# EasyEDA Pro project TC364核心板V2.1.epro

# Schematic TC364核心板V2.1

## Sheets
1 P1: Board Name: TC364核心板V2.0; Create Date: 2024-12-10
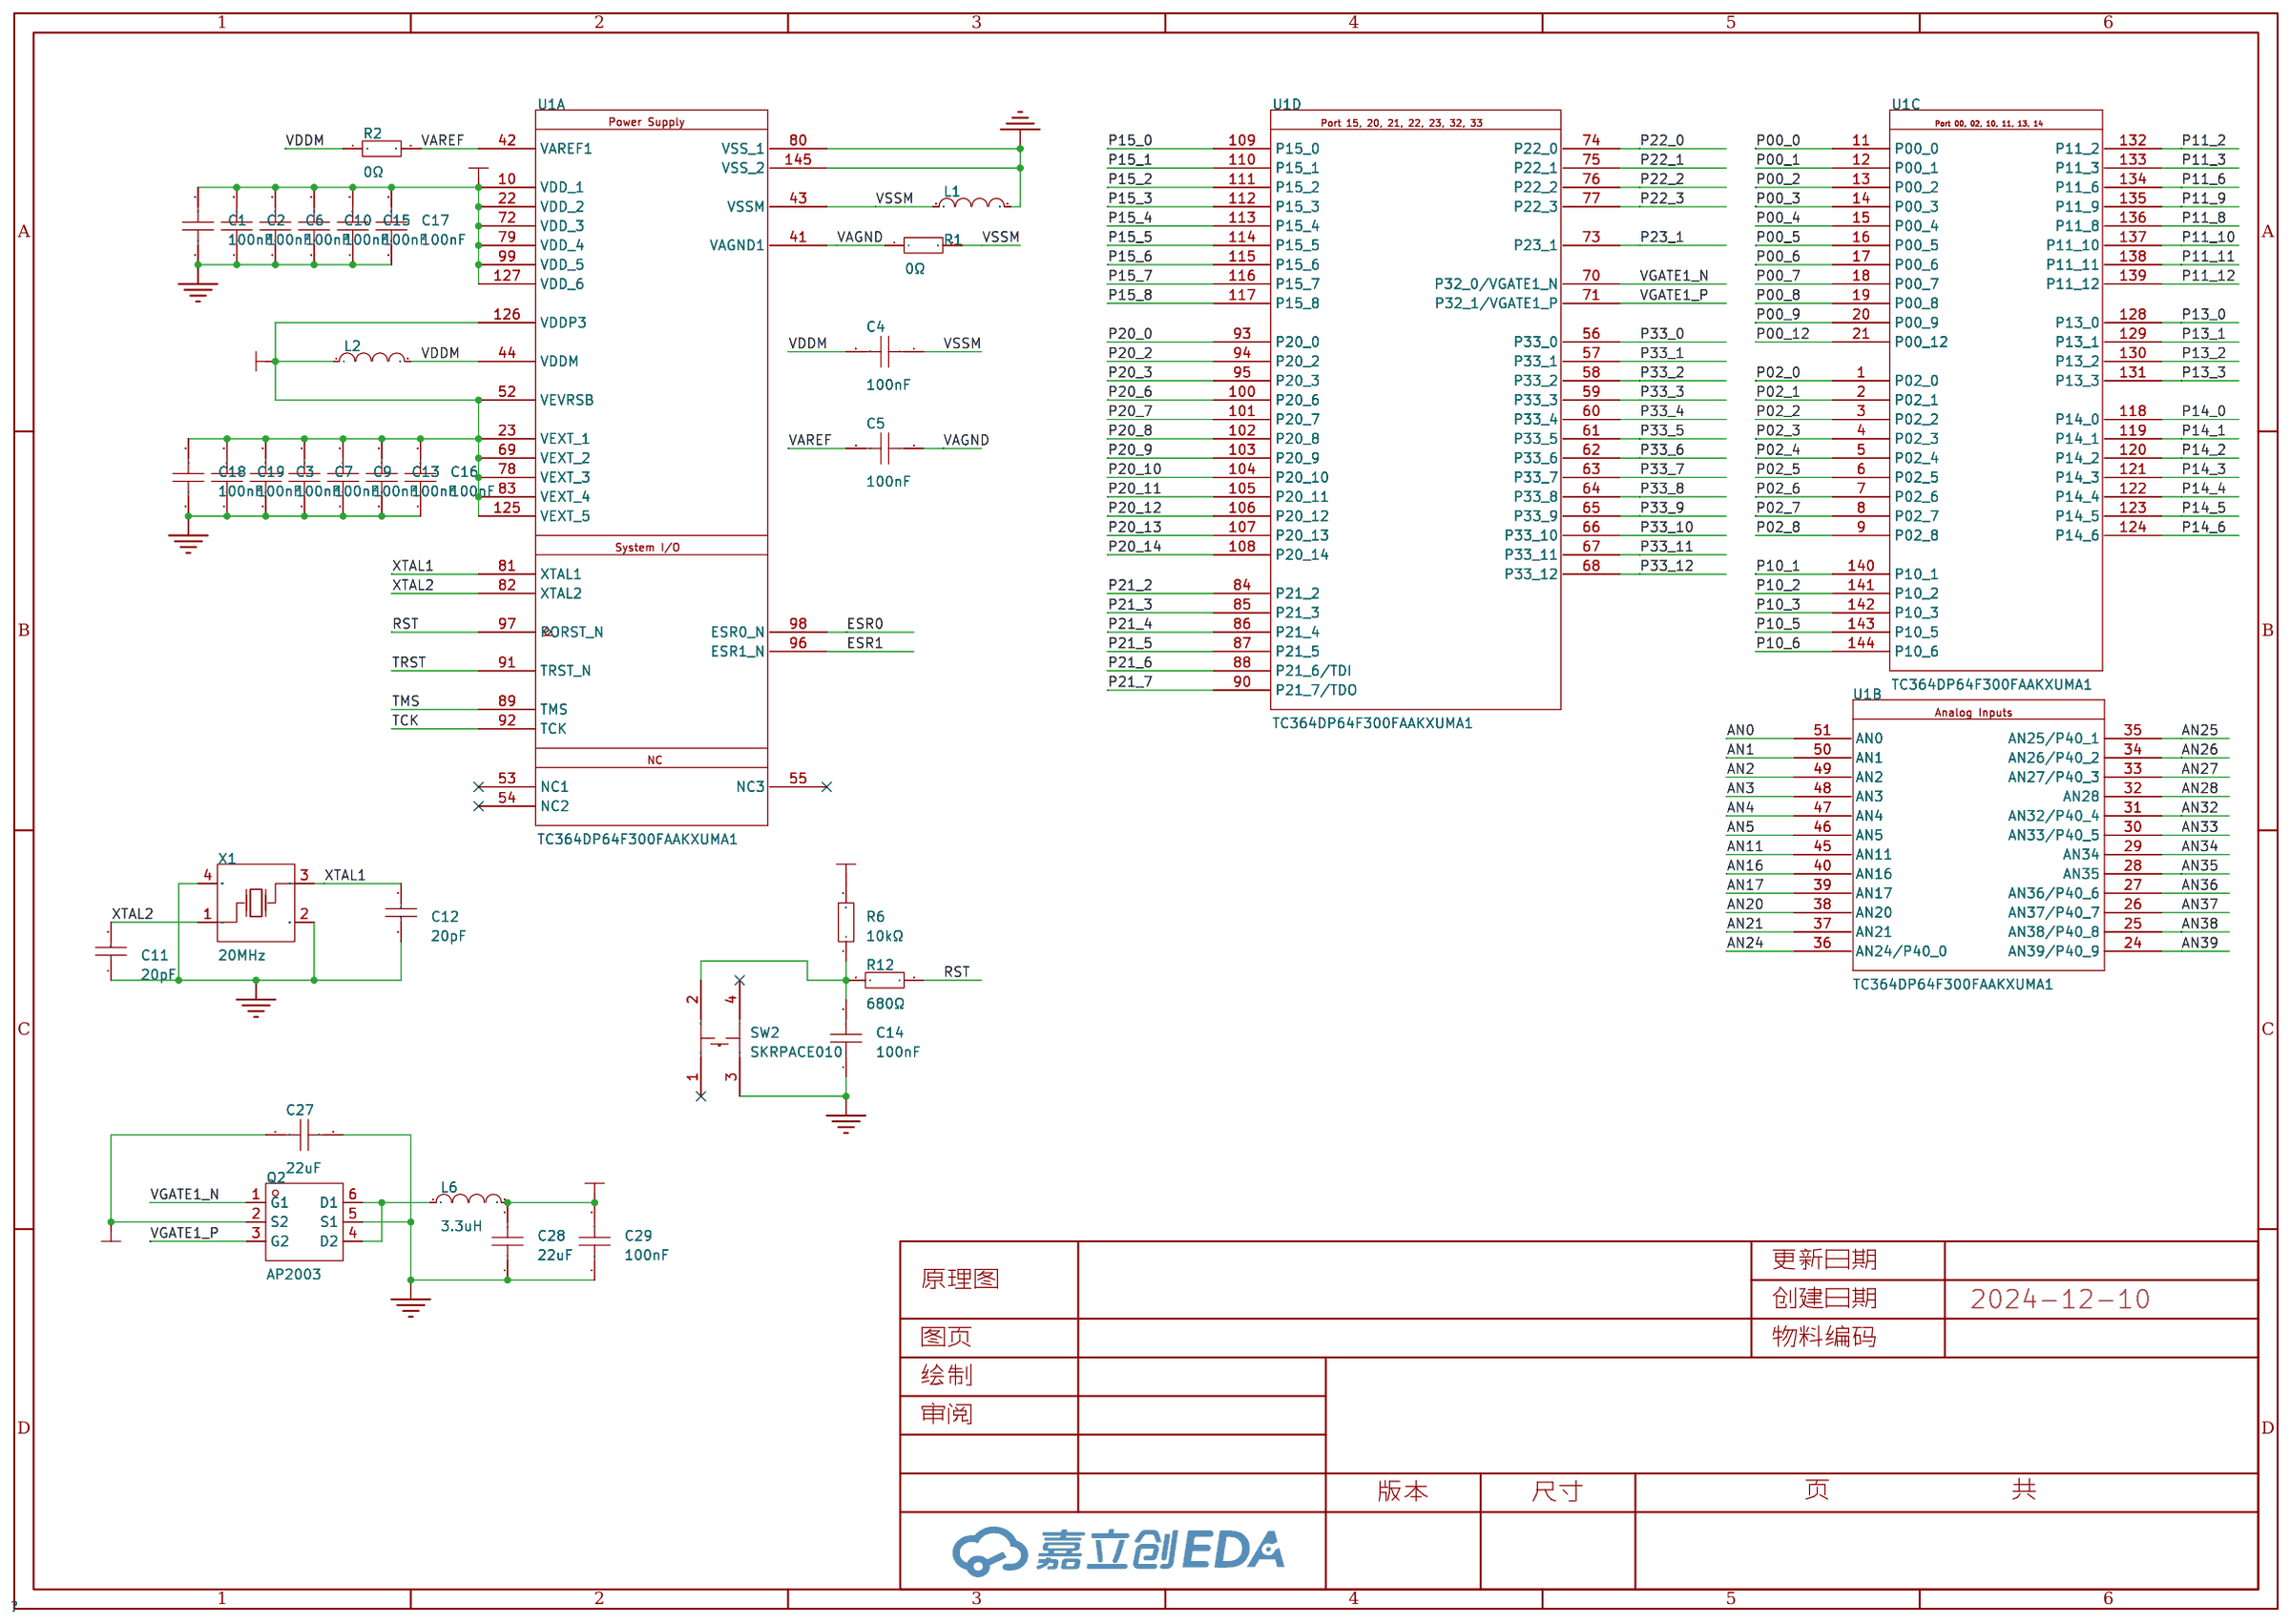
[diagram p0: P1]
2 P2: Board Name: TC364核心板V2.1
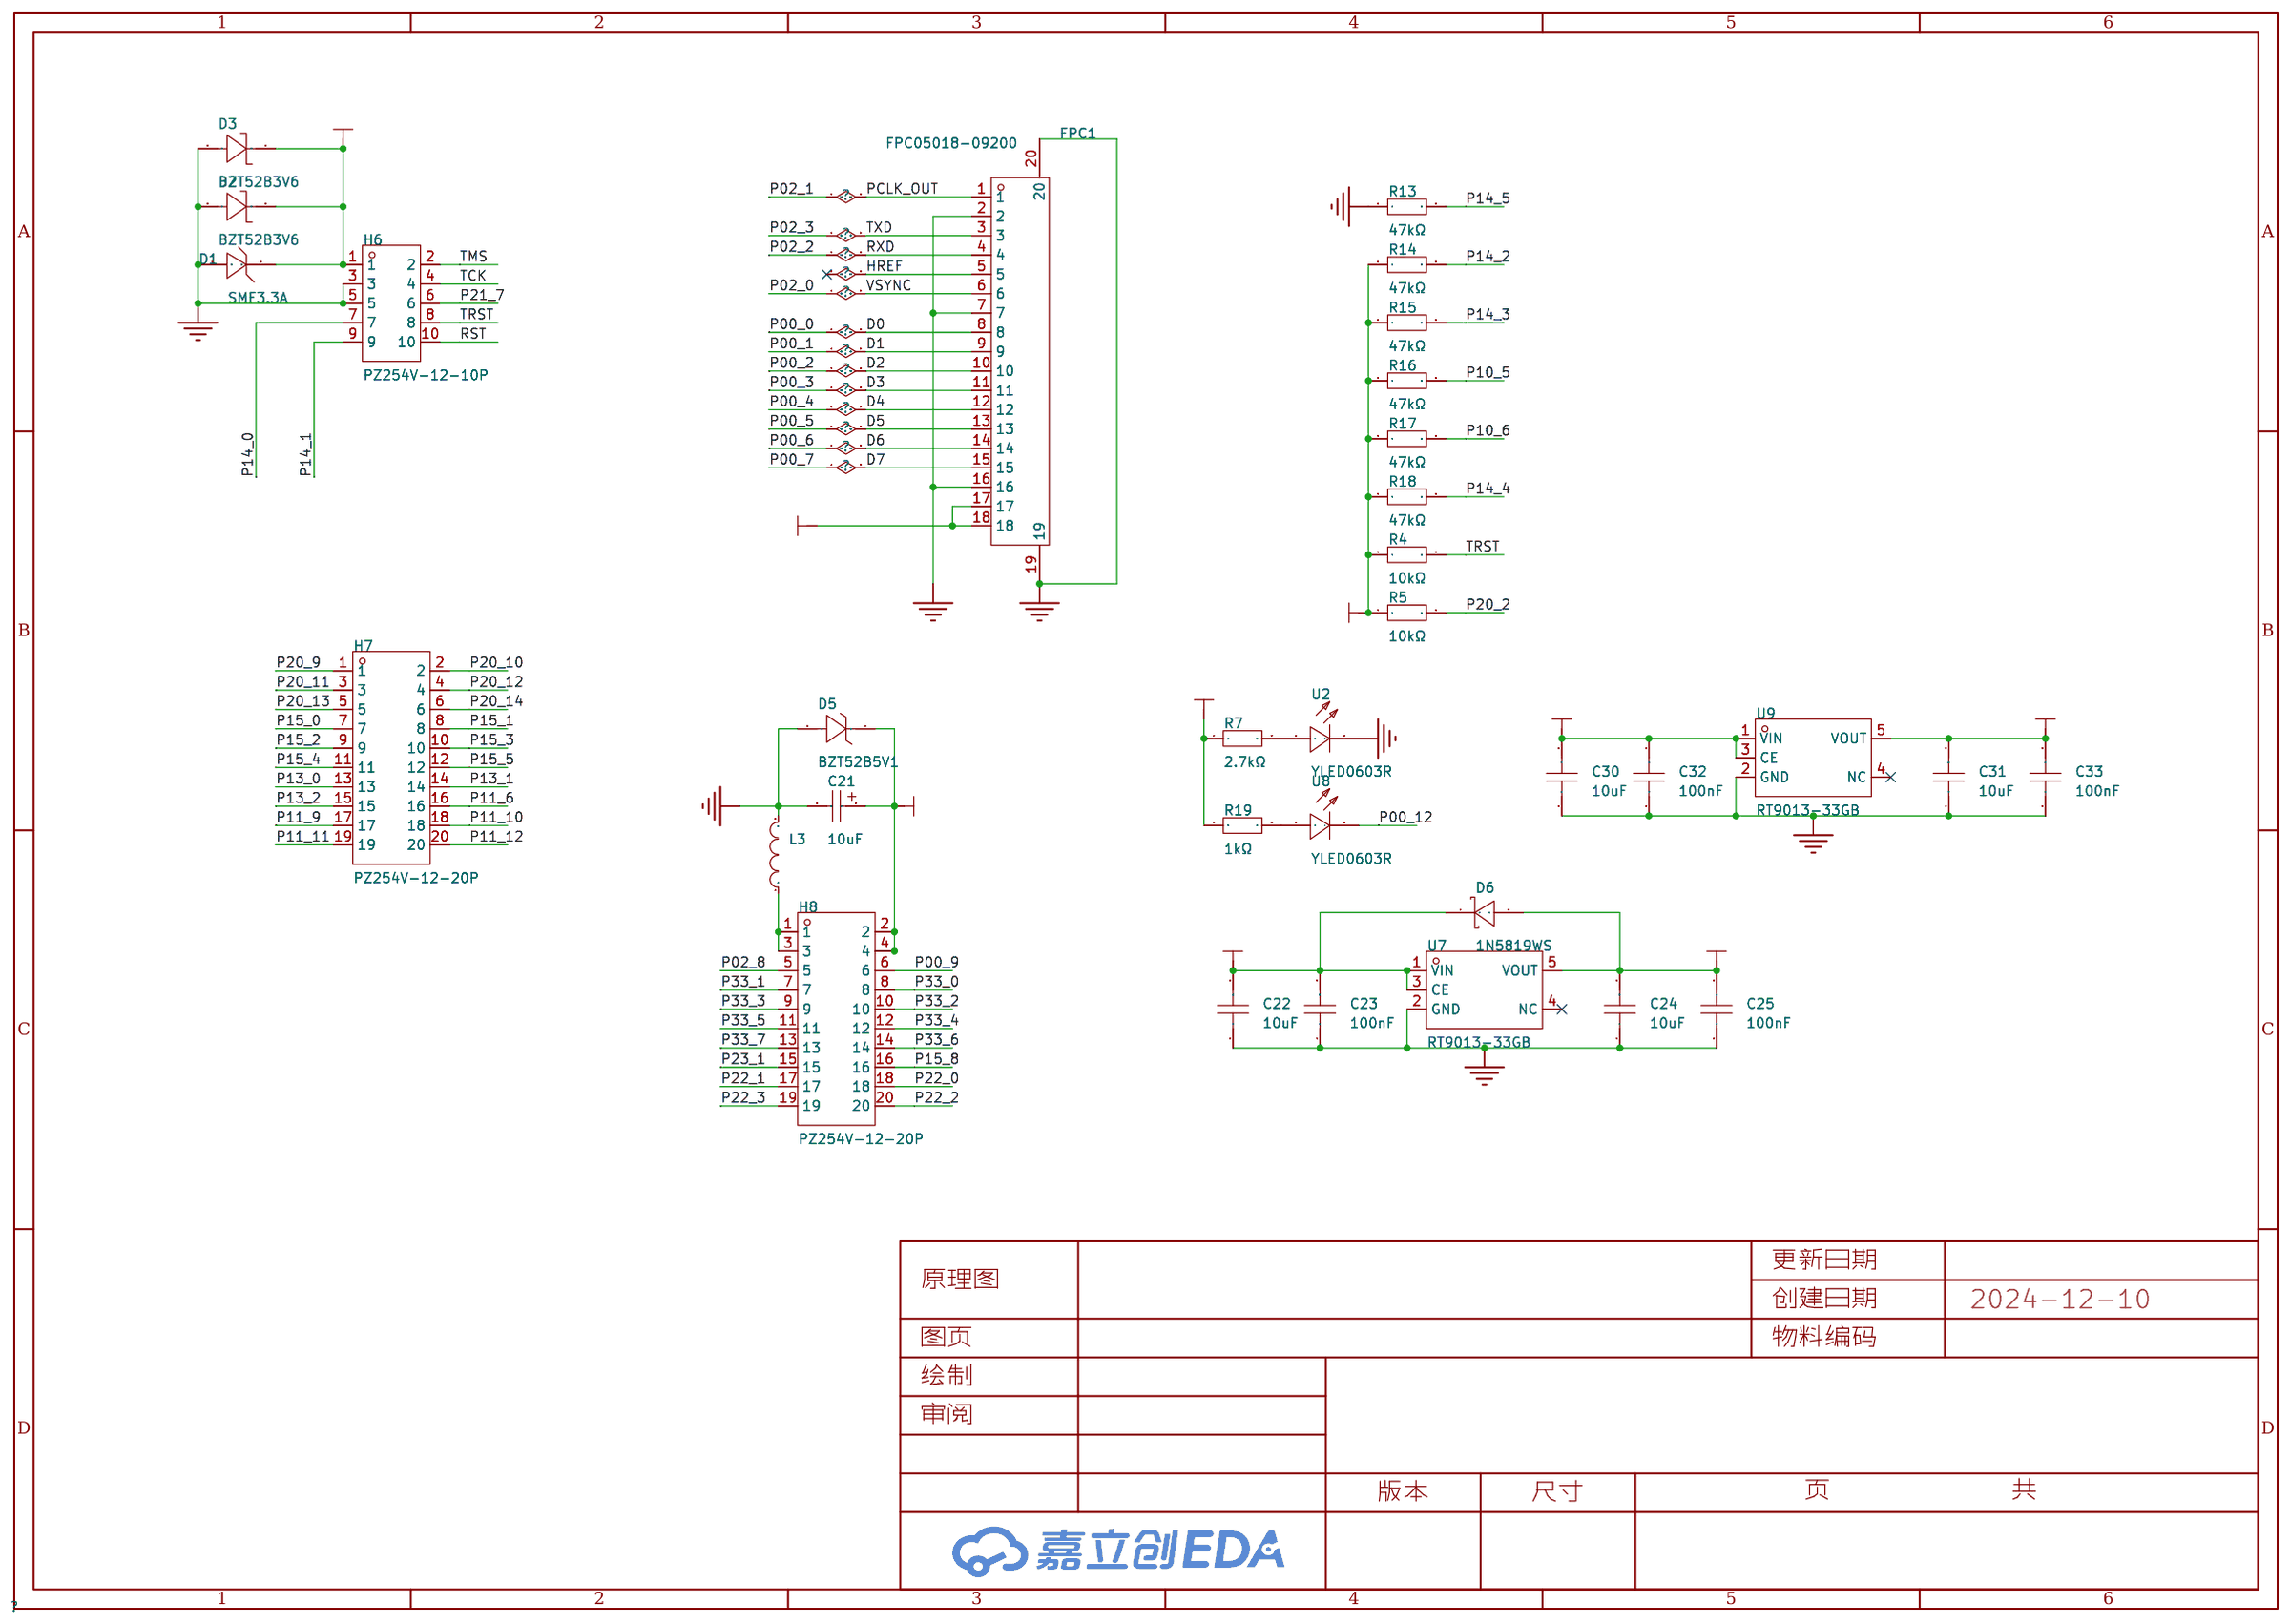
[diagram p1: P2]

## Parts
sheet P1
C1  100nF  [C0603]
C2  100nF  [C0603]
C3  100nF  [C0603]
C4  100nF  [C0603]
C5  100nF  [C0603]
C6  100nF  [C0603]
C7  100nF  [C0603]
C9  100nF  [C0603]
C10  100nF  [C0603]
C11  20pF  [C0603]
C12  20pF  [C0603]
C13  100nF  [C0603]
C14  100nF  [C0603]
C15  100nF  [C0603]
C16  100nF  [C0603]
C17  100nF  [C0603]
C18  100nF  [C0603]
C19  100nF  [C0603]
C27  22uF  [C0603]
C28  22uF  [C0603]
C29  100nF  [C0603]
L1  CBG160808U000T  [L0603]
L2  CBG160808U000T  [L0603]
L6  3.3uH  [IND-SMD_L4.4-W4.2]
Q2  AP2003  [SOT-23-6_L2.9-W1.6-P0.95-LS2.8-BR]
R1  0Ω  [R0603]
R2  0Ω  [R0603]
R6  10kΩ  [R0603]
R12  680Ω  [R0603]
SW2  SKRPACE010  [KEY-SMD_4P-L4.2-W3.2-P2.20-LS4.6]
U1  TC364DP64F300FAAKXUMA1  [PG-TQFP-144_L16.0-W16.0-P0.40-LS18.0-BR-EP5.7]  (sections 1,2,3,4)
X1  20MHz  [OSC-SMD_4P-L3.2-W2.5-BL]
sheet P2
C21  10uF  [CAP-SMD_L3.2-W1.6-RD-C7171]
C22  10uF  [C0603]
C23  100nF  [C0603]
C24  10uF  [C0603]
C25  100nF  [C0603]
C30  10uF  [C0603]
C31  10uF  [C0603]
C32  100nF  [C0603]
C33  100nF  [C0603]
D1  SMF3.3A  [SOD-123_L2.8-W1.8-LS3.7-RD]
D2  BZT52B3V6  [SOD-123_L2.7-W1.6-LS3.7-RD-A]
D3  BZT52B3V6  [SOD-123_L2.7-W1.6-LS3.7-RD-A]
D5  BZT52B5V1  [SOD-123_L2.7-W1.6-LS3.7-RD]
D6  1N5819WS  [SOD-323_L1.8-W1.3-LS2.5-RD]
FPC1  FPC05018-09200  [FPC-SMD_FPC05018-09200]
H6  PZ254V-12-10P  [HDR-TH_10P-P2.54-V-M-R2-C5-S2.54]
H7  PZ254V-12-20P  [HDR-TH_20P-P2.54-V-M-R2-C10-S2.54]
H8  PZ254V-12-20P  [HDR-TH_20P-P2.54-V-M-R2-C10-S2.54]
L3  CBG201209U000T  [L0805]
R4  10kΩ  [R0603]
R5  10kΩ  [R0603]
R7  2.7kΩ  [R0603]
R13  47kΩ  [R0603]
R14  47kΩ  [R0603]
R15  47kΩ  [R0603]
R16  47kΩ  [R0603]
R17  47kΩ  [R0603]
R18  47kΩ  [R0603]
R19  1kΩ  [R0603]
U2  YLED0603R  [LED0603-FD]
U7  RT9013-33GB  [SOT-23-5_L2.9-W1.6-P0.95-LS2.8-BR]
U8  YLED0603R  [LED0603-FD]
U9  RT9013-33GB  [SOT-23-5_L2.9-W1.6-P0.95-LS2.8-BR]

## Library data of the parts
C1-C7 C9 C10 C13-C19 C23 C25 C29 C32 C33 = CC0603KRX7R9BB104: 容值:100nF;精度:±10%;额定电压:50V;材质(温度系数):X7R;; LCSC Part Name: 100nF ±10% 50V; Supplier Part: C14663; Manufacturer: YAGEO(国巨); Supplier Footprint: 0603; JLCPCB Part Class: 基础库; Datasheet: https://atta.szlcsc.com/upload/public/pdf/source/20180910/C282072_33301C7F631E79921B82A8DAC6BCC5B3.pdf; Supplier: LCSC; Tolerance: ±10%; Voltage Rated: 50V; Temperature Coefficient: X7R
C11 C12 = CC0603JRNPO9BN200: 容值:20pF;精度:±5%;额定电压:50V;材质(温度系数):NP0;; LCSC Part Name: 20pF ±5% 50V; Supplier Part: C105621; Manufacturer: YAGEO(国巨); Supplier Footprint: 0603; JLCPCB Part Class: 扩展库; Datasheet: https://atta.szlcsc.com/upload/public/pdf/source/20170505/1493957838062.pdf; Supplier: LCSC; Tolerance: ±5%; Voltage Rated: 50V; Temperature Coefficient: NP0
C27 C28 = CL10A226MP8NUNE: 容值:22uF;精度:±20%;额定电压:10V;材质(温度系数):X5R;; LCSC Part Name: 22uF ±20% 10V; Supplier Part: C86295; Manufacturer: SAMSUNG(三星); Supplier Footprint: 0603; JLCPCB Part Class: 扩展库; Datasheet: https://atta.szlcsc.com/upload/public/pdf/source/20160218/1457707763339.pdf; Supplier: LCSC; Tolerance: ±20%; Voltage Rated: 10V; Temperature Coefficient: X5R
L1 L2 = CBG160808U000T: 标称阻抗@测试频率:0Ω@100MHz;直流电阻(RDC):100mΩ;; LCSC Part Name: 单路 0603磁珠 阻抗0Ω@100MHz; Supplier Part: C43163; Manufacturer: FH(风华); Supplier Footprint: 0603; JLCPCB Part Class: 扩展库; Datasheet: https://atta.szlcsc.com/upload/public/pdf/source/20190129/C361667_1614D407CC98D1D3CFBD9E1F7511C14D.pdf; Supplier: LCSC; Impedance @ Frequency: 0Ω@100MHz; DC Resistance: 100mΩ; Current Rating: 800mA; Circuits: 1
L6 = FAUL0420-3R3MT: 电感值:3.3uH;精度:±20%;额定电流:3.3A;饱和电流(Isat):3.5A;类型:一体成型电感;; LCSC Part Name: 3.3uH ±20% 3.5A; Supplier Part: C3040384; Manufacturer: cjiang(长江微电); Supplier Footprint: SMD,4.2x4.4mm; JLCPCB Part Class: 扩展库; Datasheet: https://atta.szlcsc.com/upload/public/pdf/source/20221201/43419F042EC034C99E4B70E898E2F3B3.pdf; Supplier: LCSC; Tolerance: ±20%; Rated Current: 3.3A; Saturation Current (Isat): 3.5A; DC Resistance (DCR): 87mΩ; Type: 一体成型电感; Ratings: AEC-Q200
Q2 = AP2003: 类型:1个N沟道+1个P沟道;漏源电压(Vdss):20V;连续漏极电流(Id):3A;导通电阻(RDS(on)@Vgs,Id):75mΩ@4.5V,2.5A;功率(Pd):800mW;阈值电压(Vgs(th)@Id):700mV@250uA;; LCSC Part Name: 1个N沟道+1个P沟道 耐压:20V 电流:3A; Supplier Part: C2849575; Manufacturer: ALLPOWER(铨力); Supplier Footprint: SOT-23-6; JLCPCB Part Class: 扩展库; Datasheet: https://atta.szlcsc.com/upload/public/pdf/source/20210723/C2849575_D5662A091ADF76BB7231C05490DE9B38.pdf; Supplier: LCSC; Type: 1个N沟道+1个P沟道; Drain Source Voltage (Vdss): 20V; Continuous Drain Current (Id): 3A; Drain Source On Resistance (RDS(on)@Vgs,Id): 75mΩ@4.5V,2.5A; Power Dissipation (Pd): 800mW; Gate Threshold Voltage (Vgs(th)@Id): 700mV@250uA; Total Gate Charge (Qg@Vgs): 3.2nC; Input Capacitance (Ciss@Vds): 325pF@10V; Reverse Transfer Capacitance (Crss@Vds): 37pF@10V; Operating Temperature: -55℃~+150℃
R1 R2 = 0603WAF0000T5E: 电阻类型:厚膜电阻;阻值:0Ω;精度:±1%;功率:100mW;最大工作电压:75V;; LCSC Part Name: 0Ω ±1% 100mW 厚膜电阻; Supplier Part: C21189; Manufacturer: UNI-ROYAL(厚声); Supplier Footprint: 0603; JLCPCB Part Class: 基础库; Datasheet: https://atta.szlcsc.com/upload/public/pdf/source/20200306/C422600_1E6D84923E4A46A82E41ADD87F860B5C.pdf; Supplier: LCSC; Type: 厚膜电阻; Tolerance: ±1%; Power(Watts): 100mW; Overload Voltage (Max): 75V; Operating Temperature Range: -55℃~+155℃
R4-R6 = 0603WAF1002T5E: 电阻类型:厚膜电阻;阻值:10kΩ;精度:±1%;功率:100mW;最大工作电压:75V;温度系数:±100ppm/℃;; LCSC Part Name: 厚膜电阻 10kΩ ±1% 100mW; Supplier Part: C25804; Manufacturer: UNI-ROYAL(厚声); Supplier Footprint: 0603; JLCPCB Part Class: 基础库; Datasheet: https://atta.szlcsc.com/upload/public/pdf/source/20200306/C422600_1E6D84923E4A46A82E41ADD87F860B5C.pdf; Supplier: LCSC; Type: 厚膜电阻; Tolerance: ±1%; Power(Watts): 100mW; Overload Voltage (Max): 75V; Temperature Coefficient: ±100ppm/℃; Operating Temperature Range: -55℃~+155℃
R12 = 0603WAF6800T5E: 电阻类型:厚膜电阻;阻值:680Ω;精度:±1%;功率:100mW;最大工作电压:75V;温度系数:±100ppm/℃;; LCSC Part Name: 680Ω ±1% 100mW 厚膜电阻; Supplier Part: C23228; Manufacturer: UNI-ROYAL(厚声); Supplier Footprint: 0603; JLCPCB Part Class: 基础库; Datasheet: https://atta.szlcsc.com/upload/public/pdf/source/20200306/C422600_1E6D84923E4A46A82E41ADD87F860B5C.pdf; Supplier: LCSC; Type: 厚膜电阻; Tolerance: ±1%; Power(Watts): 100mW; Overload Voltage (Max): 75V; Temperature Coefficient: ±100ppm/℃; Operating Temperature Range: -55℃~+155℃
SW2 = SKRPACE010: 电路结构:单刀单掷;按钮形状:椭圆形按钮;安装方式:立贴;开关长度:4.2mm;开关宽度:3.2mm;开关高度:2.5mm;触点电流:50mA;额定电压(DC):16V;带灯:-;机械寿命:-;; LCSC Part Name: 4.2*3.2*2.5mm 立贴 轻触开关; Supplier Part: C139797; Manufacturer: ALPSALPINE(阿尔卑斯阿尔派); Supplier Footprint: SMD; JLCPCB Part Class: 扩展库; Datasheet: https://atta.szlcsc.com/upload/public/pdf/source/20171113/C139797_15105612676371115729.pdf; Supplier: LCSC; Circuit: 单刀单掷; Actuator Style: 椭圆形按钮; Mounting Style: 立贴; Switch Length: 4.2mm; Switch Width: 3.2mm; Switch Height: 2.5mm; Contact Current: 50mA; Voltage Rating (DC): 16V
U1 = TC364DP64F300FAAKXUMA1: CPU内核:其他系列;程序存储容量:4MB;RAM总容量:672KB;GPIO端口数量:-;工作电压范围:-;CPU最大主频:300MHz;程序存储器类型:FLASH;; Supplier Part: C1855763; Manufacturer: Infineon(英飞凌); Supplier Footprint: TQFP-144(16x16); JLCPCB Part Class: Extended Part; Supplier: LCSC; CPU Core: 其他系列; Program Storage Size: 4MB; RAM Size: 672KB; CPU Maximum Speed: 300MHz; Program Memory Type: FLASH; Operating Temperature Range: -40℃~+125℃; Peripheral/Function: DMA；看门狗；LIN总线协议；PWM；以太网协议栈; communication protocol: 以太网协议; Watchdog: 有; Direct Memory Access: 有; Internal Oscillator: 有
X1 = X322520MSB4SI: 晶振类型:贴片晶振;频率:20MHz;常温频差:±10ppm;外接负载电容:20pF;频率稳定度(全温):±20ppm;; LCSC Part Name: 20MHz ±10ppm 20pF; Supplier Part: C9004; Manufacturer: YXC(扬兴晶振); Supplier Footprint: SMD3225-4P; JLCPCB Part Class: 扩展库; Datasheet: https://atta.szlcsc.com/upload/public/pdf/source/20240329/19D5F850207469550BEB00D7DFEDBC7A.pdf; Supplier: LCSC; Crystal Type: 贴片晶振; Normal temperature Frequency Tolerance: ±10ppm; External load capacitor: 20pF; Frequency Stability(Full temperature range): ±20ppm; Operating Temperature: -40℃~+85℃
C21 = TAJA106K016RNJ: 容值:10uF;精度:±10%;额定电压:16V;等效串联电阻:3Ω@100kHz;; LCSC Part Name: 10uF ±10% 16V; Supplier Part: C7171; Manufacturer: Kyocera AVX; Supplier Footprint: CASE-A-3216; JLCPCB Part Class: 基础库; Datasheet: https://atta.szlcsc.com/upload/public/pdf/source/20160107/1457707750344.pdf; Supplier: LCSC; Tolerance: ±10%; Rated Voltage: 16V; Equivalent Series Resistance(ESR): 3Ω@100kHz; Operating Temperature: -55℃~+125℃
C22 C24 C30 C31 = CGA0603X5R106K100JT: 容值:10uF;精度:±10%;额定电压:10V;材质(温度系数):X5R;; LCSC Part Name: 10uF ±10% 10V; Supplier Part: C6119842; Manufacturer: HRE(芯声); Supplier Footprint: 0603; JLCPCB Part Class: 扩展库; Supplier: LCSC; Tolerance: ±10%; Voltage Rated: 10V; Temperature Coefficient: X5R
D1 = SMF3.3A_C283866: 反向截止电压(Vrwm):3.3V;最大钳位电压:8V;峰值脉冲电流(Ipp)@10/1000us:25A;击穿电压:5.2V;; Supplier Part: C283866; Manufacturer: DOWO(东沃); Supplier Footprint: SOD-123FL; JLCPCB Part Class: 扩展库; Datasheet: https://atta.szlcsc.com/upload/public/pdf/source/20240321/1BA336232F2D97E4B026619682DB80D3.pdf; Supplier: LCSC; Reverse Stand-Off Voltage (Vrwm): 3.3V; Maximum Clamping Voltage: 8V; Peak Pulse Current (Ipp)@10/1000us: 25A; Breakdown Voltage: 5.2V; Reverse Leakage Current (Ir): 600uA; Type: TVS
D2 D3 = BZT52B3V6: 二极管配置:独立式;稳压值(标称值):3.6V;稳压值(范围):3.52V~3.67V;功率(Pd):500mW;; Supplier Part: C968124; Manufacturer: YANGJIE(扬杰); Supplier Footprint: SOD-123; JLCPCB Part Class: 扩展库; Datasheet: https://atta.szlcsc.com/upload/public/pdf/source/20200713/C699117_018B75DB711C6E3C0742E6ACCAAD83F8.pdf; Supplier: LCSC; Diode Configuration: 独立式; Zener Voltage (Nom): 3.6V; Reverse Leakage Current (Ir): 15uA@1V; Zener Voltage (Range): 3.52V~3.67V; Power Dissipation: 500mW; Zener Impedance (Zzt): 95Ω
D5 = BZT52B5V1_C19077393: 二极管配置:独立式;稳压值(标称值):5.1V;稳压值(范围):5V~5.2V;功率(Pd):500mW;; Supplier Part: C19077393; Manufacturer: 宏迦橙; Supplier Footprint: SOD-123; JLCPCB Part Class: 扩展库; Datasheet: https://atta.szlcsc.com/upload/public/pdf/source/20231025/7B522980EF7B3ADB7D8180AF5C922201.pdf; Supplier: LCSC; Diode Configuration: 独立式; Zener Voltage (Nom): 5.1V; Reverse Leakage Current (Ir): 2uA@2V; Zener Voltage (Range): 5V~5.2V; Power Dissipation: 500mW; Zener Impedance (Zzt): 60Ω
D6 = 1N5819WS_C191023: 正向压降(Vf):600mV@1A;直流反向耐压(Vr):40V;整流电流:1A;; LCSC Part Name: 电压:40V 电流:1A; Supplier Part: C191023; Manufacturer: Hottech(合科泰); Supplier Footprint: SOD-323; JLCPCB Part Class: 基础库; Datasheet: https://atta.szlcsc.com/upload/public/pdf/source/20220428/3CB86FD8D28D653594B4E35F9D5AEFD9.pdf; Supplier: LCSC; Forward Voltage (Vf@If): 600mV@1A; Reverse Voltage (Vr): 40V; Rectified Current: 1A
FPC1 = FPC05018-09200: 锁定特性:翻盖式;触点类型:下接;触点数量:18P;间距:0.5mm;安装类型:卧贴;工作温度范围:-25℃~+85℃;; LCSC Part Name: 间距:0.5mm P数:18P 翻盖式 下接; Supplier Part: C496146; Manufacturer: ATOM(爱特姆); Supplier Footprint: SMD,P=0.5mm,卧贴; JLCPCB Part Class: 扩展库; Datasheet: https://atta.szlcsc.com/upload/public/pdf/source/20200316/C496142_1ABE0A27956B0C1E9F30CD4659CEC744.pdf; Supplier: LCSC; Locking Feature: 翻盖式; Contact Type: 下接; Number of Contacts: 18P; Pitch: 0.5mm; Mounting Type: 卧贴; FFC, FCB Thickness: 0.3mm; Height Above Board: 2mm; Operating Temperature Range: -25℃~+85℃
H6 = PZ254V-12-10P: 插针结构:2x5P;间距:2.54mm;行距:2.54mm;圆针/方针:方针;安装类型:直插;排数:双排;总PIN位数:10P;额定电流:-;额定电压:-;配合针长度:6mm;塑高:2.5mm;端接针长度:3mm;触头材质:黄铜;触头镀层:-;工作温度范围:-40℃~+105℃;颜色:黑色;; LCSC Part Name: 间距:2.54mm 2x5P 直插 方针; Supplier Part: C492422; Manufacturer: XFCN(兴飞); Supplier Footprint: 插件,P=2.54mm; JLCPCB Part Class: 扩展库; Datasheet: https://atta.szlcsc.com/upload/public/pdf/source/20200309/C492422_5020CEA01BE7051F9EA9DD81AB0A25E3.pdf; Supplier: LCSC; Pin Structure: 2x5P; Pitch: 2.54mm; Row Spacing: 2.54mm; Circluar Pins/Square Pins: 方针; Mounting Type: 直插; Number of Rows: 双排; Number of Pins: 10P; Length of Mating Pin: 6mm; Insulation Height: 2.5mm; Length of End Connection Pin: 3mm; Contact Material: 黄铜; Operating Temperature Range: -40℃~+105℃; Color: 黑色
H7 H8 = PZ254V-12-20P: 插针结构:2x10P;间距:2.54mm;行距:2.54mm;圆针/方针:方针;安装类型:直插;排数:双排;总PIN位数:20P;额定电流:-;额定电压:-;配合针长度:6mm;塑高:2.5mm;端接针长度:3mm;触头材质:黄铜;触头镀层:-;工作温度范围:-40℃~+105℃;颜色:黑色;; LCSC Part Name: 间距:2.54mm 2x10P 直插 方针; Supplier Part: C492427; Manufacturer: XFCN(兴飞); Supplier Footprint: 插件,P=2.54mm; JLCPCB Part Class: 扩展库; Datasheet: https://atta.szlcsc.com/upload/public/pdf/source/20200309/C492427_9411E93D35F2EC20CED9A3ED9F4BBE60.pdf; Supplier: LCSC; Pin Structure: 2x10P; Pitch: 2.54mm; Row Spacing: 2.54mm; Circluar Pins/Square Pins: 方针; Mounting Type: 直插; Number of Rows: 双排; Number of Pins: 20P; Length of Mating Pin: 6mm; Insulation Height: 2.5mm; Length of End Connection Pin: 3mm; Contact Material: 黄铜; Operating Temperature Range: -40℃~+105℃; Color: 黑色
L3 = CBG201209U000T: 标称阻抗@测试频率:0Ω@100MHz;直流电阻(RDC):80mΩ;; LCSC Part Name: 单路 0805磁珠 阻抗0Ω@100MHz; Supplier Part: C91037; Manufacturer: FH(风华); Supplier Footprint: 0805; JLCPCB Part Class: 扩展库; Datasheet: https://atta.szlcsc.com/upload/public/pdf/source/20161217/1481939213023.pdf; Supplier: LCSC; Impedance @ Frequency: 0Ω@100MHz; DC Resistance: 80mΩ; Current Rating: 900mA; Circuits: 1
R7 R19 = 0603WAF2701T5E: 电阻类型:厚膜电阻;阻值:2.7kΩ;精度:±1%;功率:100mW;最大工作电压:75V;温度系数:±100ppm/℃;; LCSC Part Name: 2.7kΩ ±1% 100mW 厚膜电阻; Supplier Part: C13167; Manufacturer: UNI-ROYAL(厚声); Supplier Footprint: 0603; JLCPCB Part Class: 基础库; Datasheet: https://atta.szlcsc.com/upload/public/pdf/source/20200306/C422600_1E6D84923E4A46A82E41ADD87F860B5C.pdf; Supplier: LCSC; Type: 厚膜电阻; Tolerance: ±1%; Power(Watts): 100mW; Overload Voltage (Max): 75V; Temperature Coefficient: ±100ppm/℃; Operating Temperature Range: -55℃~+155℃
R13-R18 = 0603WAF4702T5E: 电阻类型:厚膜电阻;阻值:47kΩ;精度:±1%;功率:100mW;最大工作电压:75V;温度系数:±100ppm/℃;; LCSC Part Name: 47kΩ ±1% 100mW 厚膜电阻; Supplier Part: C25819; Manufacturer: UNI-ROYAL(厚声); Supplier Footprint: 0603; JLCPCB Part Class: Basic Part; Datasheet: https://atta.szlcsc.com/upload/public/pdf/source/20200306/C422600_1E6D84923E4A46A82E41ADD87F860B5C.pdf; Supplier: LCSC; Type: 厚膜电阻; Tolerance: ±1%; Power(Watts): 100mW; Overload Voltage (Max): 75V; Temperature Coefficient: ±100ppm/℃; Operating Temperature Range: -55℃~+155℃
U2 U8 = YLED0603R: 发光颜色:红色;正向电压(VF):1.8V~2.4V;功率:-;正向电流:25mA;主波长:620nm~625nm;二极管配置:-;透镜颜色:-;色温:-;发光强度:-;发光角度:-;载带方式:-;工作温度:-40℃~+85℃;; Supplier Part: C19171390; Manufacturer: YONGYUTAI(永裕泰); Supplier Footprint: 0603; JLCPCB Part Class: 扩展库; Datasheet: https://atta.szlcsc.com/upload/public/pdf/source/20231027/FB19AF06E2C70028E58AB5CEDD1BDC72.pdf; Supplier: LCSC; Emitted Color: 红色; Forward Voltage (VF): 1.8V~2.4V; Forward Current: 25mA; Dominant Wavelength: 620nm~625nm; Operating Temperature: -40℃~+85℃
U7 U9 = RT9013-33GB_C19268157: Supplier Part: C19268157; Manufacturer: TECH PUBLIC(台舟); Supplier Footprint: SOT-23-5; JLCPCB Part Class: 扩展库; Datasheet: https://atta.szlcsc.com/upload/public/pdf/source/20231201/9D78CA17020D67EC103F1AC7C29CF260.pdf; Supplier: LCSC

## Nets
GND: C1.1 C2.1 C3.1 C6.1 C7.1 C9.1 C10.1 C11.1 C12.1 C13.1 C14.1 C15.1 C16.1 C17.1 C18.1 C19.1 C21.2 C22.1 C23.1 C24.1 C25.1 C27.2 C28.1 C29.1 C30.1 C31.1 C32.1 C33.1 D1.2 D2.2(A) D3.2(A) D5.2(A) FPC1.2 FPC1.7 FPC1.16 FPC1.19 FPC1.20 H6.3 H6.5 L1.2 L3.2 Q2.5(S1) R13.1 SW2.3 U1.80(VSS_1) U1.145(VSS_2) U2.2(-) U7.2(GND) U9.2(GND) X1.2(GND) X1.4(GND)
VCC1V25: C1.2 C2.2 C6.2 C10.2 C15.2 C17.2 C28.2 C29.2 L6.2 U1.10(VDD_1) U1.22(VDD_2) U1.72(VDD_3) U1.79(VDD_4) U1.99(VDD_5) U1.127(VDD_6)
VCC3V3: C3.2 C7.2 C9.2 C13.2 C16.2 C18.2 C19.2 C24.2 C25.2 C27.1 D1.1 D2.1(K) D3.1(K) D6.2(A) H6.1 L2.1 Q2.2(S2) R4.1 R5.1 R6.2 R7.1 R14.1 R15.1 R16.1 R17.1 R18.1 R19.1 U1.23(VEXT_1) U1.52(VEVRSB) U1.69(VEXT_2) U1.78(VEXT_3) U1.83(VEXT_4) U1.125(VEXT_5) U1.126(VDDP3) U7.5(VOUT)
VCC5V: C21.1 C22.2 C23.2 C30.2 C32.2 D5.1(K) D6.1(K) H8.2 H8.4 U7.1(VIN) U7.3(CE) U9.1(VIN) U9.3(CE)
VCCCAM: C31.2 C33.2 FPC1.17 FPC1.18 U9.5(VOUT)
VDDM: C4.2 L2.2 R2.1 U1.44(VDDM)
VSSM: C4.1 L1.1 R1.2 U1.43(VSSM)
AN0: U1.51(AN0)
AN1: U1.50(AN1)
AN2: U1.49(AN2)
AN3: U1.48(AN3)
AN4: U1.47(AN4)
AN5: U1.46(AN5)
AN11: U1.45(AN11)
AN16: U1.40(AN16)
AN17: U1.39(AN17)
AN20: U1.38(AN20)
AN21: U1.37(AN21)
AN24: U1.36(AN24/P40_0)
AN25: U1.35(AN25/P40_1)
AN26: U1.34(AN26/P40_2)
AN27: U1.33(AN27/P40_3)
AN28: U1.32(AN28)
AN32: U1.31(AN32/P40_4)
AN33: U1.30(AN33/P40_5)
AN34: U1.29(AN34)
AN35: U1.28(AN35)
AN36: U1.27(AN36/P40_6)
AN37: U1.26(AN37/P40_7)
AN38: U1.25(AN38/P40_8)
AN39: U1.24(AN39/P40_9)
D0: FPC1.8 U1.11(P00_0)
D1: FPC1.9 U1.12(P00_1)
D2: FPC1.10 U1.13(P00_2)
D3: FPC1.11 U1.14(P00_3)
D4: FPC1.12 U1.15(P00_4)
D5: FPC1.13 U1.16(P00_5)
D6: FPC1.14 U1.17(P00_6)
D7: FPC1.15 U1.18(P00_7)
ESR0: U1.98(ESR0_N)
ESR1: U1.96(ESR1_N)
HREF: FPC1.5
P00_8: U1.19(P00_8)
P00_9: H8.6 U1.20(P00_9)
P00_12: U1.21(P00_12) U8.2(-)
P02_0: FPC1.6 U1.1(P02_0)
P02_1: FPC1.1 U1.2(P02_1)
P02_2: FPC1.4 U1.3(P02_2)
P02_3: FPC1.3 U1.4(P02_3)
P02_4: U1.5(P02_4)
P02_5: U1.6(P02_5)
P02_6: U1.7(P02_6)
P02_7: U1.8(P02_7)
P02_8: H8.5 U1.9(P02_8)
P10_1: U1.140(P10_1)
P10_2: U1.141(P10_2)
P10_3: U1.142(P10_3)
P10_5: R16.2 U1.143(P10_5)
P10_6: R17.2 U1.144(P10_6)
P11_2: U1.132(P11_2)
P11_3: U1.133(P11_3)
P11_6: H7.16 U1.134(P11_6)
P11_8: U1.136(P11_8)
P11_9: H7.17 U1.135(P11_9)
P11_10: H7.18 U1.137(P11_10)
P11_11: H7.19 U1.138(P11_11)
P11_12: H7.20 U1.139(P11_12)
P13_0: H7.13 U1.128(P13_0)
P13_1: H7.14 U1.129(P13_1)
P13_2: H7.15 U1.130(P13_2)
P13_3: U1.131(P13_3)
P14_0: H6.7 U1.118(P14_0)
P14_1: H6.9 U1.119(P14_1)
P14_2: R14.2 U1.120(P14_2)
P14_3: R15.2 U1.121(P14_3)
P14_4: R18.2 U1.122(P14_4)
P14_5: R13.2 U1.123(P14_5)
P14_6: U1.124(P14_6)
P15_0: H7.7 U1.109(P15_0)
P15_1: H7.8 U1.110(P15_1)
P15_2: H7.9 U1.111(P15_2)
P15_3: H7.10 U1.112(P15_3)
P15_4: H7.11 U1.113(P15_4)
P15_5: H7.12 U1.114(P15_5)
P15_6: U1.115(P15_6)
P15_7: U1.116(P15_7)
P15_8: H8.16 U1.117(P15_8)
P20_0: U1.93(P20_0)
P20_2: R5.2 U1.94(P20_2)
P20_3: U1.95(P20_3)
P20_6: U1.100(P20_6)
P20_7: U1.101(P20_7)
P20_8: U1.102(P20_8)
P20_9: H7.1 U1.103(P20_9)
P20_10: H7.2 U1.104(P20_10)
P20_11: H7.3 U1.105(P20_11)
P20_12: H7.4 U1.106(P20_12)
P20_13: H7.5 U1.107(P20_13)
P20_14: H7.6 U1.108(P20_14)
P21_2: U1.84(P21_2)
P21_3: U1.85(P21_3)
P21_4: U1.86(P21_4)
P21_5: U1.87(P21_5)
P21_6: U1.88(P21_6/TDI)
P21_7: H6.6 U1.90(P21_7/TDO)
P22_0: H8.18 U1.74(P22_0)
P22_1: H8.17 U1.75(P22_1)
P22_2: H8.20 U1.76(P22_2)
P22_3: H8.19 U1.77(P22_3)
P23_1: H8.15 U1.73(P23_1)
P33_0: H8.8 U1.56(P33_0)
P33_1: H8.7 U1.57(P33_1)
P33_2: H8.10 U1.58(P33_2)
P33_3: H8.9 U1.59(P33_3)
P33_4: H8.12 U1.60(P33_4)
P33_5: H8.11 U1.61(P33_5)
P33_6: H8.14 U1.62(P33_6)
P33_7: H8.13 U1.63(P33_7)
P33_8: U1.64(P33_8)
P33_9: U1.65(P33_9)
P33_10: U1.66(P33_10)
P33_11: U1.67(P33_11)
P33_12: U1.68(P33_12)
RST: H6.10 R12.2 U1.97(PORST_N)
TCK: H6.4 U1.92(TCK)
TMS: H6.2 U1.89(TMS)
TRST: H6.8 R4.2 U1.91(TRST_N)
VAGND: C5.1 R1.1 U1.41(VAGND1)
VAREF: C5.2 R2.2 U1.42(VAREF1)
VGATE1_N: Q2.1(G1) U1.70(P32_0/VGATE1_N)
VGATE1_P: Q2.3(G2) U1.71(P32_1/VGATE1_P)
XTAL1: C12.2 U1.81(XTAL1) X1.3(OSC2)
XTAL2: C11.2 U1.82(XTAL2) X1.1(OSC1)
$1N2260: C14.2 R6.1 R12.1 SW2.2
$1N3513: L6.1 Q2.4(D2) Q2.6(D1)
$2N1878: H8.1 H8.3 L3.1
$2N2355: R7.2 U2.1(+)
$2N2718: R19.2 U8.1(+)

Not connected (* = marked no-connect by the designer): SW2 1* 4*; U1 53(NC1)* 54(NC2)* 55(NC3)*; U7 4(NC)*; U9 4(NC)*

# Board TC364核心板V2.1
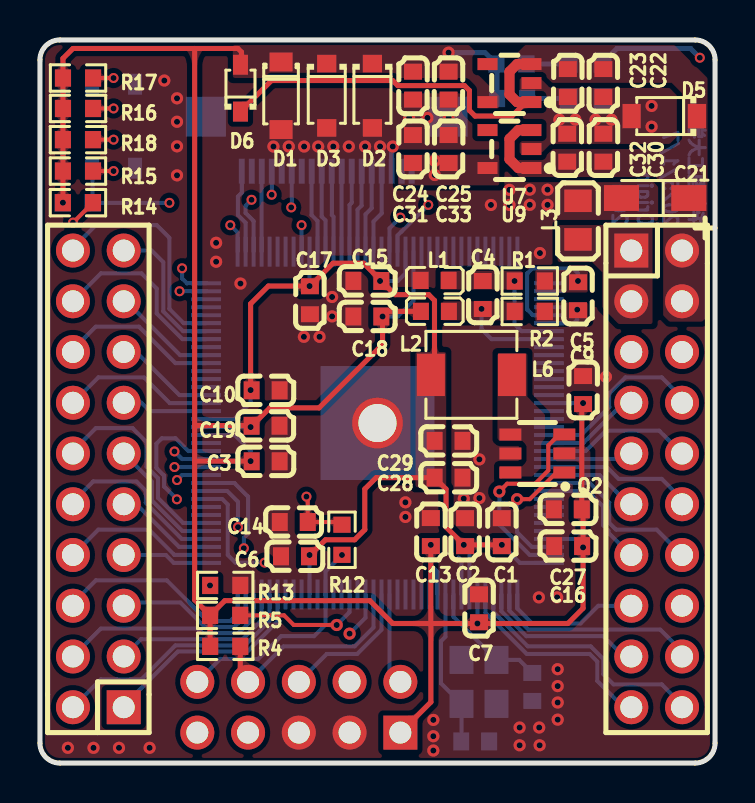
[diagram p2: board, top side]
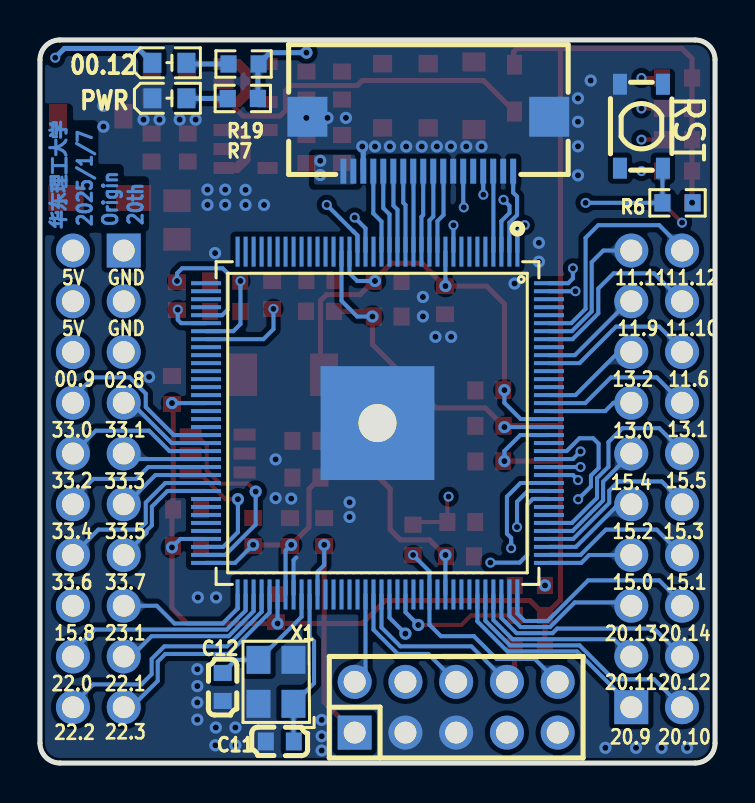
[diagram p3: board, bottom side, seen from below]

Outline 33.78 x 36.2 mm; copper layers: Top Layer, Inner1, Inner2, Bottom Layer. Coordinates in mm from the lower left corner of the outline.
Outline path: 0,35.2 0,1 arc(0.29,0.29) 1,0 32.78,0 arc(33.49,0.29) 33.78,1 33.78,35.2 arc(33.49,35.9) 32.78,36.2 1,36.2 arc(0.29,35.9) 0,35.2
Stack: Top Layer 0.035mm 外层铜厚1oz / Dielectric1 0.2104mm 7628 RC49% 8.6mil / Inner1 0.0152mm 内层铜厚 / Dielectric2 1.065mm 1.1mm H/HOZ Copper / Inner2 0.0152mm 内层铜厚 / Dielectric3 0.2104mm 7628 RC49% 8.6mil / Bottom Layer 0.035mm 外层铜厚1oz

## Design rules (mm)
template: 4层
spacing copperThickness1oz (default): track to track 0.102, other pairs 0.152 to 0.3
spacing copperThickness2oz: track to track 0.203, other pairs 0.152 to 0.3
spacing copperThicknessInner0.5oz: track to track 0.089, other pairs 0.152 to 0.3
track width copperThickness1oz (default): min 0.102, default 0.254, max 2.54
track width copperThickness2oz: min 0.203, default 0.254, max 2.54
track width copperThickness0.5oz: min 0.089, default 0.254, max 2.54
differential pair differentialPair (default): width min 0.127, default 0.254, max 2.54; gap min 0.152, default 0.152
via viaSize (default): diameter min 0.3, default 0.61, max 10; hole min 0.2, default 0.305, max 6.3

## Placement (name value [footprint] x y rotation side)
C1  100nF  [C0603]  23.11 11.56 270 top
C2  100nF  [C0603]  21.27 11.56 270 top
C3  100nF  [C0603]  11.29 15.1 180 top
C4  100nF  [C0603]  22.16 23.43 270 top
C5  100nF  [C0603]  26.92 23.37 270 top
C6  100nF  [C0603]  12.76 10.35 0 top
C7  100nF  [C0603]  21.97 7.75 270 top
C9  100nF  [C0603]  27.18 18.67 270 top
C10  100nF  [C0603]  11.29 18.66 180 top
C11  20pF  [C0603]  21.78 1.08 180 bottom
C12  20pF  [C0603]  24.64 3.81 90 bottom
C13  100nF  [C0603]  19.56 11.56 270 top
C14  100nF  [C0603]  12.7 12.06 0 top
C15  100nF  [C0603]  16.38 24.13 0 top
C16  100nF  [C0603]  26.43 10.86 0 top
C17  100nF  [C0603]  13.51 23.17 90 top
C18  100nF  [C0603]  16.38 22.35 0 top
C19  100nF  [C0603]  11.29 16.88 180 top
C21  10uF  [CAP-SMD_L3.2-W1.6-RD-C7171]  30.78 28.28 180 top
C22  10uF  [C0603]  28.19 34.04 90 top
C23  100nF  [C0603]  26.42 34.04 90 top
C24  10uF  [C0603]  18.67 33.91 90 top
C25  100nF  [C0603]  20.45 33.91 90 top
C27  22uF  [C0603]  26.42 12.7 180 top
C28  22uF  [C0603]  20.45 14.29 180 top
C29  100nF  [C0603]  20.45 16.13 180 top
C30  10uF  [C0603]  28.19 30.8 270 top
C31  10uF  [C0603]  18.66 30.73 270 top
C32  100nF  [C0603]  26.39 30.8 270 top
C33  100nF  [C0603]  20.45 30.73 270 top
D1  SMF3.3A  [SOD-123_L2.8-W1.8-LS3.7-RD]  12.06 33.4 270 top
D2  BZT52B3V6  [SOD-123_L2.7-W1.6-LS3.7-RD-A]  16.64 33.4 270 top
D3  BZT52B3V6  [SOD-123_L2.7-W1.6-LS3.7-RD-A]  14.35 33.4 270 top
D5  BZT52B5V1  [SOD-123_L2.7-W1.6-LS3.7-RD]  31.24 32.39 180 top
D6  1N5819WS  [SOD-323_L1.8-W1.3-LS2.5-RD]  10.03 33.78 90 top
FPC1  FPC05018-09200  [FPC-SMD_FPC05018-09200]  14.35 30.99 0 bottom
H6  PZ254V-12-10P  [HDR-TH_10P-P2.54-V-M-R2-C5-S2.54]  12.95 2.79 180 bottom
H7  PZ254V-12-20P  [HDR-TH_20P-P2.54-V-M-R2-C10-S2.54]  2.92 14.22 90 top
H8  PZ254V-12-20P  [HDR-TH_20P-P2.54-V-M-R2-C10-S2.54]  30.86 14.22 270 top
L1  CBG160808U000T  [L0603]  19.75 24.16 180 top
L2  CBG160808U000T  [L0603]  19.76 22.61 0 top
L3  CBG201209U000T  [L0805]  26.92 27.18 90 top
L6  3.3uH  [IND-SMD_L4.4-W4.2]  21.59 19.43 0 top
NOREF  -  [Pad_e2695]  16.89 17.02 0 top
Q2  AP2003  [SOT-23-6_L2.9-W1.6-P0.95-LS2.8-BR]  24.89 15.49 0 top
R1  0Ω  [R0603]  24.51 24.13 180 top
R2  0Ω  [R0603]  24.51 22.61 0 top
R4  10kΩ  [R0603]  9.27 5.84 0 top
R5  10kΩ  [R0603]  9.27 7.39 0 top
R6  10kΩ  [R0603]  1.88 28.04 180 bottom
R7  2.7kΩ  [R0603]  23.63 33.27 0 bottom
R12  680Ω  [R0603]  15.11 11.18 270 top
R13  47kΩ  [R0603]  9.27 8.89 180 top
R14  47kΩ  [R0603]  1.9 28.05 0 top
R15  47kΩ  [R0603]  1.9 29.63 0 top
R16  47kΩ  [R0603]  1.91 32.77 0 top
R17  47kΩ  [R0603]  1.91 34.29 0 top
R18  47kΩ  [R0603]  1.9 31.2 0 top
R19  1kΩ  [R0603]  23.59 34.99 0 bottom
SW2  SKRPACE010  [KEY-SMD_4P-L4.2-W3.2-P2.20-LS4.6]  3.68 31.88 270 bottom
U1  TC364DP64F300FAAKXUMA1  [PG-TQFP-144_L16.0-W16.0-P0.40-LS18.0-BR-EP5.7]  16.89 17.02 90 bottom
U2  YLED0603R  [LED0603-FD]  27.3 33.27 0 bottom
U7  RT9013-33GB  [SOT-23-5_L2.9-W1.6-P0.95-LS2.8-BR]  23.5 34.04 0 top
U8  YLED0603R  [LED0603-FD]  27.3 35.05 0 bottom
U9  RT9013-33GB  [SOT-23-5_L2.9-W1.6-P0.95-LS2.8-BR]  23.5 30.73 0 top
X1  20MHz  [OSC-SMD_4P-L3.2-W2.5-BL]  21.97 4.06 90 bottom

## Footprints (pads in the part's own frame, mm; a bottom-side part is the same pattern mirrored in y, then rotated)
C0603
  rect 0.8x0.9 smd: 1(-0.7,0) 2(0.7,0)
CAP-SMD_L3.2-W1.6-RD-C7171
  rect 1.758x1.296 smd: 1(-1.687,0) 2(1.687,0)
FPC-SMD_FPC05018-09200
  rect 0.3x1.25 smd: 1(-4.25,1.363) 2(-3.75,1.363) 3(-3.25,1.363) 4(-2.75,1.363) 5(-2.25,1.363) 6(-1.75,1.363) 7(-1.25,1.363) 8(-0.75,1.363) 9(-0.25,1.363) 10(0.25,1.363) 11(0.75,1.363) 12(1.25,1.363) 13(1.75,1.363) 14(2.25,1.363) 15(2.75,1.363) 16(3.25,1.363) 17(3.75,1.363) 18(4.25,1.363)
  rect 2x2 smd: 19(6.05,-1.363) 20(-6.05,-1.363)
HDR-TH_10P-P2.54-V-M-R2-C5-S2.54
  rect 1.7x1.7 hole 1.1: 1(-5.08,-1.27)
  round 1.7 hole 1.1: 2(-5.08,1.27) 3(-2.54,-1.27) 4(-2.54,1.27) 5(0,-1.27) 6(0,1.27) 7(2.54,-1.27) 8(2.54,1.27) 9(5.08,-1.27) 10(5.08,1.27)
HDR-TH_20P-P2.54-V-M-R2-C10-S2.54
  rect 1.7x1.7 hole 1.1: 1(-11.43,-1.27)
  round 1.7 hole 1.1: 2(-11.43,1.27) 3(-8.89,-1.27) 4(-8.89,1.27) 5(-6.35,-1.27) 6(-6.35,1.27) 7(-3.81,-1.27) 8(-3.81,1.27) 9(-1.27,-1.27) 10(-1.27,1.27) 11(1.27,-1.27) 12(1.27,1.27) 13(3.81,-1.27) 14(3.81,1.27) 15(6.35,-1.27) 16(6.35,1.27) 17(8.89,-1.27) 18(8.89,1.27) 19(11.43,-1.27) 20(11.43,1.27)
IND-SMD_L4.4-W4.2
  rect 1.4x2.12 smd: 1(2.028,0) 2(-2.028,0)
KEY-SMD_4P-L4.2-W3.2-P2.20-LS4.6
  rect 1.05x0.7 smd: 1(-2.1,1.075) 2(2.1,1.075) 3(-2.1,-1.075) 4(2.1,-1.075)
L0603
  rect 0.8x0.864 smd: 1(-0.7,0) 2(0.7,0)
L0805
  rect 1.133x1.377 smd: 1(-0.966,0) 2(0.966,0)
LED0603-FD
  rect 0.9x1 smd: 1(-0.85,0) 2(0.85,0)
OSC-SMD_4P-L3.2-W2.5-BL
  rect 1.4x1.2 smd: 1(-1.1,-0.875) 2(1.1,-0.875) 3(1.1,0.875) 4(-1.1,0.875)
Pad_e2695
  round 2.54 hole 1.905: 1(0,0)
PG-TQFP-144_L16.0-W16.0-P0.40-LS18.0-BR-EP5.7
  rect 1.5x0.2 smd: 1(8.58,-7) 2(8.58,-6.6) 3(8.58,-6.2) 4(8.58,-5.8) 5(8.58,-5.4) 6(8.58,-5) 7(8.58,-4.6) 8(8.58,-4.2) 9(8.58,-3.8) 10(8.58,-3.4) 11(8.58,-3) 12(8.58,-2.6) 13(8.58,-2.2) 14(8.58,-1.8) 15(8.58,-1.4) 16(8.58,-1) 17(8.58,-0.6) 18(8.58,-0.2) 19(8.58,0.2) 20(8.58,0.6) 21(8.58,1) 22(8.58,1.4) 23(8.58,1.8) 24(8.58,2.2) 25(8.58,2.6) 26(8.58,3) 27(8.58,3.4) 28(8.58,3.8) 29(8.58,4.2) 30(8.58,4.6) 31(8.58,5) 32(8.58,5.4) 33(8.58,5.8) 34(8.58,6.2) 35(8.58,6.6) 36(8.58,7) 73(-8.58,7) 74(-8.58,6.6) 75(-8.58,6.2) 76(-8.58,5.8) 77(-8.58,5.4) 78(-8.58,5) 79(-8.58,4.6) 80(-8.58,4.2) 81(-8.58,3.8) 82(-8.58,3.4) 83(-8.58,3) 84(-8.58,2.6) 85(-8.58,2.2) 86(-8.58,1.8) 87(-8.58,1.4) 88(-8.58,1) 89(-8.58,0.6) 90(-8.58,0.2) 91(-8.58,-0.2) 92(-8.58,-0.6) 93(-8.58,-1) 94(-8.58,-1.4) 95(-8.58,-1.8) 96(-8.58,-2.2) 97(-8.58,-2.6) 98(-8.58,-3) 99(-8.58,-3.4) 100(-8.58,-3.8) 101(-8.58,-4.2) 102(-8.58,-4.6) 103(-8.58,-5) 104(-8.58,-5.4) 105(-8.58,-5.8) 106(-8.58,-6.2) 107(-8.58,-6.6) 108(-8.58,-7)
  rect 0.2x1.5 smd: 37(7,8.58) 38(6.6,8.58) 39(6.2,8.58) 40(5.8,8.58) 41(5.4,8.58) 42(5,8.58) 43(4.6,8.58) 44(4.2,8.58) 45(3.8,8.58) 46(3.4,8.58) 47(3,8.58) 48(2.6,8.58) 49(2.2,8.58) 50(1.8,8.58) 51(1.4,8.58) 52(1,8.58) 53(0.6,8.58) 54(0.2,8.58) 55(-0.2,8.58) 56(-0.6,8.58) 57(-1,8.58) 58(-1.4,8.58) 59(-1.8,8.58) 60(-2.2,8.58) 61(-2.6,8.58) 62(-3,8.58) 63(-3.4,8.58) 64(-3.8,8.58) 65(-4.2,8.58) 66(-4.6,8.58) 67(-5,8.58) 68(-5.4,8.58) 69(-5.8,8.58) 70(-6.2,8.58) 71(-6.6,8.58) 72(-7,8.58) 109(-7,-8.58) 110(-6.6,-8.58) 111(-6.2,-8.58) 112(-5.8,-8.58) 113(-5.4,-8.58) 114(-5,-8.58) 115(-4.6,-8.58) 116(-4.2,-8.58) 117(-3.8,-8.58) 118(-3.4,-8.58) 119(-3,-8.58) 120(-2.6,-8.58) 121(-2.2,-8.58) 122(-1.8,-8.58) 123(-1.4,-8.58) 124(-1,-8.58) 125(-0.6,-8.58) 126(-0.2,-8.58) 127(0.2,-8.58) 128(0.6,-8.58) 129(1,-8.58) 130(1.4,-8.58) 131(1.8,-8.58) 132(2.2,-8.58) 133(2.6,-8.58) 134(3,-8.58) 135(3.4,-8.58) 136(3.8,-8.58) 137(4.2,-8.58) 138(4.6,-8.58) 139(5,-8.58) 140(5.4,-8.58) 141(5.8,-8.58) 142(6.2,-8.58) 143(6.6,-8.58) 144(7,-8.58)
  rect 5.7x5.7 smd: 145(0,0)
R0603
  rect 0.806x0.864 smd: 1(-0.753,0) 2(0.753,0)
SOD-123_L2.7-W1.6-LS3.7-RD
  rect 0.91x1.22 smd: 1(-1.635,0) 2(1.635,0)
SOD-123_L2.7-W1.6-LS3.7-RD-A
  rect 0.88x0.96 smd: 1(-1.61,0) 2(1.61,0)
SOD-123_L2.8-W1.8-LS3.7-RD
  rect 0.95x1.15 smd: 1(-1.692,0) 2(1.692,0)
SOD-323_L1.8-W1.3-LS2.5-RD
  rect 1x0.75 smd: 1(-1.173,0) 2(1.173,0)
SOT-23-5_L2.9-W1.6-P0.95-LS2.8-BR
  rect 1x0.6 smd: 1(1.1,-0.95) 2(1.1,0) 3(1.1,0.95) 4(-1.1,0.95) 5(-1.1,-0.95)
SOT-23-6_L2.9-W1.6-P0.95-LS2.8-BR
  rect 1.1x0.6 smd: 1(1.35,-0.95) 2(1.35,0) 3(1.35,0.95) 4(-1.35,0.95) 5(-1.35,0) 6(-1.35,-0.95)

## Nets
As in the schematic, except:
GND: C1.1 C2.1 C3.1 C6.1 C7.1 C9.1 C10.1 C11.1 C12.1 C13.1 C14.1 C15.1 C16.1 C17.1 C18.1 C19.1 C21.2 C22.1 C23.1 C24.1 C25.1 C27.2 C28.1 C29.1 C30.1 C31.1 C32.1 C33.1 D1.2 D2.2 D3.2 D5.2 FPC1.2 FPC1.7 FPC1.16 FPC1.19 FPC1.20 H6.3 H6.5 L1.2 L3.2 NOREF.1 Q2.5 R13.1 SW2.3 U1.80 U1.145 U2.2 U7.2 U9.2 X1.2 X1.4

Pads without a net: SW2 1 4; U1 53 54 55; U7 4; U9 4

## Via types
v1: diameter 0.61, hole 0.305, Top Layer to Bottom Layer, 83 vias
v2: diameter 0.5, hole 0.299, Top Layer to Bottom Layer, 29 vias

## Routing (per net, layer and track width the routed paths; a pad name or vN(x,y) marks a point on that pad's centre or on a via; arc(x,y) is an arc through that point)
GND: length 3.2
  Bottom Layer w0.203: 20.95,10.29 21.09,10.15 U1.80
  Bottom Layer w0.254: FPC1.16 17.6,30.81 v1(17.65,30.86)
  vias: v1(1.4,0.76) v1(2.68,0.76) v1(3.95,0.76) v1(5.49,0.76) v1(6.22,34.16) v1(6.86,33.27) v1(6.86,32.1) v1(6.86,30.87) v1(6.86,29.42) v1(8.81,26.04) v1(8.81,25.09) v1(10.03,24) v1(11.68,30.86) v1(12.45,30.86) v1(13.22,30.86) v1(13.21,21.34) v1(13.92,30.86) v1(13.99,21.34) v1(14.62,23.33) v1(14.62,22.36) v1(14.68,30.86) v1(15.46,30.86) v1(16.27,30.86) v1(17.02,30.86) v1(18.29,13.05) v1(18.29,12.32) v1(18.47,32.29) v1(19.39,32.29) v1(19.69,2.16) v1(19.69,1.34) v1(19.69,0.63) v1(20.45,32.29) v1(21.21,13.24) v1(21.99,15.2) v1(21.99,13.26) v1(22.57,27.94) v1(23.5,28.69) v1(23.5,27.94) v1(24,1.78) v1(24,0.89) v1(24.51,28.7) v1(24.51,27.94) v1(25.02,25.53) v1(24.97,8.29) v1(24.98,1.78) v1(25,0.89) v1(25.4,28.7) v1(25.4,27.94) v1(25.88,8.29) v1(25.91,4.7) v1(25.91,3.85) v1(25.91,3.03) v1(25.91,2.17) v1(25.99,32.21) v1(26.79,32.21) v1(27.8,32.21) v1(28.32,19.33) v1(28.6,32.21) v1(30.61,32.89) v1(30.61,31.85)
VCC1V25: length 49
  Top Layer w0.203: v1(13.49,10.41) 13.46,10.39 C6.2 ; v1(23.11,10.92) 23.11,10.92 C1.2 ; v1(17.02,24.13) C15.2
  Top Layer w0.254: v1(21.21,10.92) C2.2 ; v1(21.21,10.92) 23.05,10.92 C1.2 ; v1(21.21,10.92) 20.32,11.81 20.32,13.71 C28.2 16.83,14.29 16.26,13.72 16.26,11.68 15.75,11.18 14.29,11.18 C6.2 ; 13.52,23.88 14.66,25.02 16.19,25.02 C15.2 17.77,23.45 19.45,23.45 19.74,23.16 19.74,19.61 L6.2 ; 10.59,18.66 10.54,18.71 10.54,22.99 11.43,23.88 v1(13.49,23.88)
  Bottom Layer w0.203: v1(10.54,18.67) 10.54,18.03 9.72,17.22 U1.127 ; U1.22 18.29,24.51 17.91,24.13 v1(17.02,24.13) ; v1(23.11,10.92) 24.02,10.02 U1.72 ; U1.79 21.49,10.64 v1(21.21,10.92) ; U1.10 v1(13.49,23.88) ; U1.99 v1(13.49,10.41)
VCC3V3: length 126.8
  Top Layer w0.203: v1(10.54,15.11) 10.55,15.1 C3.2 ; v1(27.18,18.02) C9.2 ; 10.59,16.87 C19.2 ; 21.91,6.98 C7.2 ; v1(19.56,10.92) 19.56,10.92 C13.2 ; 27.18,10.81 C16.2 ; v1(17.14,22.35) C18.2
  Top Layer w0.254: v1(10.54,16.82) 10.46,16.89 7.74,16.89 ; v1(17.14,22.35) 17.4,22.61 L2.1 ; H6.1 19.56,3.05 19.56,6.98 ; R4.1 8.51,5.85 R5.1 ; 7.74,35.77 9.91,35.77 10.09,35.59 10.09,35.01 D6.2 ; 7.74,35.77 7.74,16.89 ; 7.74,35.77 1.65,35.77 1.15,35.27 R17.1 R16.1 1.15,28.05 v1(1.15,28.05) ; 19.56,6.98 19.56,6.99 v1(19.56,10.92) ; 19.56,6.98 17.65,6.98 16.51,8.13 9.25,8.13 R5.1 ; 19.56,6.98 v1(21.89,6.98) 26.42,6.98 27.18,7.75 v1(27.18,10.8) 27.18,12.64 C27.1 27.12,17.91 C9.2 ; R5.1 7.74,8.17 7.74,15.1 ; 7.74,15.1 7.75,15.11 v1(10.54,15.11) ; 7.74,15.1 7.74,16.89 ; C18.2 17.14,22.29 17.14,20.95 13.97,17.78 11.5,17.78 10.59,16.87
  Bottom Layer w0.203: v1(10.54,15.11) 10.54,15.62 9.74,16.42 U1.125 ; U1.126 v1(10.54,16.82) ; v1(19.56,10.92) 19.56,9.91 19.89,9.57 U1.83 ; U1.78 v1(21.89,6.98) ; U1.69 26.75,11.22 v1(27.18,10.8) ; U1.23 18.69,23.14 17.91,22.35 v1(17.14,22.35) ; U1.52 v1(27.18,18.02)
  Bottom Layer w0.254: v1(20.45,35.56) 22.27,35.56 R19.1 22.88,34.95 R7.1
VCC5V: length 23.5
  Top Layer w0.254: D6.1 11.59,34.16 17.65,34.16 17.91,33.91 21.25,33.91 21.49,33.67 21.49,32.67 21.77,32.39 23.62,32.39 24.32,33.09
  Top Layer w0.508: U9.3 23.94,31.68 23.5,31.24 23.5,30.23 23.94,29.78 U9.1 ; 24.47,33.09 23.88,33.09 23.5,33.47 23.5,34.6 23.88,34.99 24.47,34.99
VCCCAM:
  vias: v1(19.76,30.15) v1(19.76,29.43)
VDDM: length 4.7
  Top Layer w0.203: C4.2 22.16,22.73 v2(22.1,22.73)
  Bottom Layer w0.203: v2(22.1,22.73) 22.1,21.72 22.6,21.22 U1.44
VSSM: length 4
  Top Layer w0.203: v2(23.75,24.13) R1.2
  Bottom Layer w0.203: v2(23.75,24.13) 23.75,21.97 24.1,21.62 U1.43
D0: length 4.2
  Bottom Layer w0.203: U1.11 13.89,27.13 13.59,27.43 13.59,29.61 FPC1.8
D1: length 4.1
  Bottom Layer w0.203: FPC1.9 14.1,29.62 14.1,27.36 14.29,27.16 U1.12
D2: length 4.1
  Bottom Layer w0.203: U1.13 14.69,27.35 14.6,27.43 14.6,29.62 FPC1.10
D3: length 4
  Bottom Layer w0.203: U1.14 15.09,29.62 FPC1.11
D4: length 4.1
  Bottom Layer w0.203: U1.15 15.49,27.94 15.6,28.05 FPC1.12
D5: length 4.1
  Bottom Layer w0.203: U1.16 15.89,27.7 16.09,27.91 16.09,29.62 FPC1.13
D6: length 4.2
  Bottom Layer w0.203: FPC1.14 16.6,27.78 16.29,27.47 U1.17
D7: length 4.2
  Bottom Layer w0.203: U1.18 16.69,27.11 17.1,27.52 FPC1.15
P00_9: length 20.2
  Inner1 w0.203: H8.6 32.13,20.7 30.99,21.84 29.3,21.84 28.45,22.7 28.45,24.89 26.03,27.31 v2(18.03,27.31)
  Bottom Layer w0.203: v2(18.03,27.31) 17.49,26.76 U1.20
P00_12: length 28.1
  Inner1 w0.203: v2(19.43,27.94) 20.83,29.34 32.38,29.34 33.02,29.97 v2(33.02,35.31)
  Bottom Layer w0.203: U1.21 17.89,26.41 18.09,26.6 18.09,26.6 v2(19.43,27.94)
  Bottom Layer w0.254: U8.2 28.87,35.77 32.56,35.77 v2(33.02,35.31)
P02_0: length 6.8
  Inner1 w0.203: v2(9.52,26.92) 9.52,27.1 9.73,27.31 12.06,27.31 v2(12.57,27.81)
  Bottom Layer w0.203: v2(9.52,26.92) 9.89,26.56 U1.1 ; FPC1.6 12.6,27.84 v2(12.57,27.81)
P02_1: length 4.3
  Bottom Layer w0.203: U1.2 10.29,27.05 9.91,27.43 9.91,28.36 10.1,28.55 FPC1.1
P02_2: length 5.2
  Inner1 w0.203: v2(10.59,28.19) 11.34,28.19 v2(11.59,28.45)
  Bottom Layer w0.203: v2(10.59,28.19) 10.29,27.89 10.29,27.53 10.69,27.13 U1.3 ; v2(11.59,28.45) 11.6,28.45 FPC1.4
P02_3: length 4
  Bottom Layer w0.203: FPC1.3 11.09,29.62 U1.4
P02_8: length 22.4
  Inner1 w0.203: H8.5 29.59,21.12 28.14,22.57 28.14,24.56 26.16,26.54 17.65,26.54 16.76,27.43 13.6,27.43 v2(13.09,26.92)
  Bottom Layer w0.203: U1.9 v2(13.09,26.92)
P10_5: length 13.5
  Top Layer w0.203: R16.2 v2(3.68,32.77)
  Inner1 w0.203: v2(6.98,23.62) 5.64,24.96 5.64,31.83 4.7,32.77 v2(3.68,32.77)
  Bottom Layer w0.203: U1.143 v2(6.98,23.62)
P10_6: length 14.5
  Top Layer w0.203: R17.2 v2(3.68,34.29)
  Inner1 w0.203: v2(7.11,24.77) 5.94,25.93 5.94,33.3 4.95,34.29 v2(3.68,34.29)
  Bottom Layer w0.203: U1.144 7.35,24.02 7.11,24.26 v2(7.11,24.77)
P11_6: length 8
  Bottom Layer w0.203: U1.134 6.78,20.02 4.95,21.84 2.79,21.84 1.65,20.7 H7.16
P11_9: length 5.2
  Bottom Layer w0.203: H7.17 4.32,23.11 7.01,20.42 U1.135
P11_10: length 9.3
  Bottom Layer w0.203: U1.137 7.13,21.22 5.84,22.5 5.84,23.75 5.08,24.51 3.05,24.51 H7.18
P11_11: length 7.2
  Bottom Layer w0.203: U1.138 7.16,21.62 6.17,22.61 6.17,25.07 5.59,25.65 H7.19
P11_12: length 11.4
  Bottom Layer w0.203: H7.20 1.65,25.78 2.79,26.92 5.84,26.92 6.48,26.29 6.48,22.73 7.19,22.02 U1.139
P13_0: length 4.3
  Bottom Layer w0.203: U1.128 5.5,17.62 5.08,18.03 H7.13
P13_1: length 7.7
  Bottom Layer w0.203: U1.129 6.49,18.02 5.21,19.3 2.92,19.3 H7.14
P13_2: length 5
  Bottom Layer w0.203: U1.130 6.98,18.42 4.83,20.57 H7.15
P14_0: length 14.5
  Inner1 w0.203: H6.7 11.56,2.67 11.56,4.95 10.71,5.8 10.71,11.01 v2(9.91,11.81)
  Bottom Layer w0.203: U1.118 9.37,13.62 9.91,13.08 v2(9.91,11.81)
P14_1: length 15.2
  Inner1 w0.203: 7.87,1.52 9.14,2.79 9.14,7.24 10.2,8.3 v2(10.2,10.75)
  Bottom Layer w0.203: U1.119 9.73,14.02 10.41,13.33 10.41,11.48 10.2,11.27 v2(10.2,10.75)
P14_2: length 22.5
  Top Layer w0.203: v2(1.65,27.05) 1.66,27.05 R14.2
  Inner1 w0.203: v2(6.86,14.17) 1.42,14.17 0.51,15.08 0.51,26.54 1.02,27.05 v2(1.65,27.05)
  Bottom Layer w0.203: U1.120 7.11,14.42 v2(6.86,14.17)
P14_3: length 19.8
  Top Layer w0.203: R15.2 v2(3.68,29.63)
  Inner1 w0.203: v2(6.73,14.82) 4.78,16.76 3.9,16.76 2.92,17.74 2.92,26.54 3.68,27.31 v2(3.68,29.63)
  Bottom Layer w0.203: U1.121 v2(6.73,14.82)
P14_4: length 20
  Top Layer w0.203: R18.2 v2(3.68,31.2)
  Inner1 w0.203: v2(3.68,31.2) 4.28,31.2 5.33,30.15 5.33,16.99 v2(6.73,15.6)
  Bottom Layer w0.203: U1.122 7.11,15.22 v2(6.73,15.6)
P14_5: length 11.1
  Top Layer w0.203: v1(8.51,8.89) R13.2
  Inner1 w0.203: v1(8.51,8.89) 8.51,11.54 v2(6.85,13.2)
  Bottom Layer w0.203: U1.123 7.42,15.62 6.78,16.26 6.1,16.26 5.83,15.99 5.83,14.77 6.21,14.39 6.21,13.84 v2(6.85,13.2)
P15_0: length 4.3
  Bottom Layer w0.203: H7.7 6.3,10.41 6.7,10.02 U1.109
P15_1: length 7.7
  Bottom Layer w0.203: U1.110 6.73,10.42 5.46,11.68 2.92,11.68 H7.8
P15_2: length 5
  Bottom Layer w0.203: U1.111 6.96,10.82 4.83,12.95 H7.9
P15_3: length 8.8
  Bottom Layer w0.203: H7.10 1.65,13.08 2.67,14.1 4.83,14.1 5.29,13.63 5.29,13.02 7.1,11.22 U1.112
P15_4: length 6.3
  Bottom Layer w0.203: H7.11 5.6,14.08 5.6,13.15 7.13,11.62 U1.113
P15_5: length 10.5
  Bottom Layer w0.203: U1.114 7.16,12.02 5.91,13.27 5.91,14.26 5.33,14.83 5.33,16.06 4.63,16.76 2.79,16.76 1.65,15.62 H7.12
P15_8: length 27.5
  Inner1 w0.203: v2(11.24,10.03) 12,9.27 30.73,9.27 H8.16
  Bottom Layer w0.203: v2(11.24,10.03) 9.78,10.03 9.4,10.41 9.4,12.94 9.12,13.22 U1.117
P20_2: length 6.8
  Top Layer w0.203: v1(14.85,6.91) 12.7,6.91 12.22,7.39 R5.2
  Bottom Layer w0.203: v1(14.85,6.91) 15.49,7.55 U1.94
P20_9: length 10.9
  Bottom Layer w0.203: H7.1 4.19,2.87 6.91,5.59 10.39,5.59 11.89,7.09 U1.103
P20_10: length 12.9
  Bottom Layer w0.203: H7.2 3.05,4.19 5.08,4.19 6.78,5.89 10.26,5.89 11.49,7.12 U1.104
P20_11: length 8.9
  Bottom Layer w0.203: U1.105 11.09,7.15 10.13,6.2 5.05,6.2 H7.3
P20_12: length 11.2
  Bottom Layer w0.203: H7.4 3.05,6.73 7.9,6.73 8.13,6.5 9.93,6.5 10.69,7.26 U1.106
P20_13: length 8
  Bottom Layer w0.203: U1.107 10.29,7.37 9.73,6.81 8.26,6.81 7.02,8.04 4.36,8.04 H7.5
P20_14: length 10.8
  Bottom Layer w0.203: H7.6 1.65,8 2.79,9.14 6.35,9.14 8.38,7.11 9.52,7.11 9.89,7.48 U1.108
P21_7: length 7
  Bottom Layer w0.203: H6.6 14.35,5.46 15.88,5.46 17.09,6.68 U1.90
P22_0: length 10.5
  Bottom Layer w0.203: H8.18 32.13,5.59 31.04,6.68 24.44,6.68 23.49,7.63 U1.74
P22_1: length 8.3
  Bottom Layer w0.203: H8.17 29.21,5.33 28.19,6.35 24.34,6.35 23.09,7.6 U1.75
P22_2: length 12.8
  Bottom Layer w0.203: H8.20 32.13,2.92 31.11,3.94 28.7,3.94 28.19,4.45 28.19,5.21 27.56,5.84 24.41,5.84 22.69,7.57 U1.76
P22_3: length 10.7
  Bottom Layer w0.203: H8.19 29.21,2.79 27.89,4.11 27.89,5.08 27.51,5.46 24.36,5.46 22.29,7.53 U1.77
P23_1: length 7.1
  Bottom Layer w0.203: U1.73 23.89,7.73 24.64,6.98 27.05,6.98 27.94,7.87 H8.15
P33_0: length 8.9
  Bottom Layer w0.203: U1.56 27.09,16.42 28.49,17.82 28.49,18.49 29.3,19.3 31.11,19.3 32.13,18.29 H8.8
P33_1: length 5
  Bottom Layer w0.203: H8.7 29.21,18.03 27.19,16.02 U1.57
P33_2: length 7.6
  Bottom Layer w0.203: U1.58 27.3,15.62 28.32,16.64 30.99,16.64 H8.10
P33_3: length 4.2
  Bottom Layer w0.203: H8.9 29.31,15.22 U1.59
P33_4: length 7.6
  Bottom Layer w0.203: H8.12 32.13,13.21 31.11,14.22 28.96,14.22 28.36,14.82 U1.60
P33_5: length 4.7
  Bottom Layer w0.203: H8.11 29.46,12.95 28,14.42 U1.61
P33_6: length 8.7
  Bottom Layer w0.203: U1.62 27.51,14.02 28.49,13.04 28.49,12.03 28.83,11.68 30.86,11.68 H8.14
P33_7: length 6.1
  Bottom Layer w0.203: H8.13 29.55,10.41 28.45,11.52 28.45,11.63 28.18,11.9 28.18,12.84 27.4,13.62 U1.63
RST: length 11.4
  Top Layer w0.203: v2(15.11,10.41) R12.2
  Bottom Layer w0.203: v2(15.11,10.41) 14.29,9.59 U1.97 14.29,6.92 13.72,6.35 12.06,6.35 10.93,5.21 9.02,5.21 7.87,4.06
TCK: length 4.7
  Inner1 w0.203: v1(15.49,6.48) 15.49,4.06
  Bottom Layer w0.203: v1(15.49,6.48) 16.29,7.27 U1.92
TMS: length 4.6
  Bottom Layer w0.203: U1.89 17.49,4.61 H6.2
TRST: length 11
  Top Layer w0.254: R4.2 10.02,4.45 H6.8
  Bottom Layer w0.203: H6.8 12.19,5.84 15.75,5.84 16.69,6.78 U1.91
VAGND: length 6.2
  Top Layer w0.203: v2(26.92,24.13) C5.1
  Bottom Layer w0.203: v2(26.92,24.13) 26.92,24.51 26.67,24.77 24.64,24.77 24.38,24.51 24.38,22.7 24.66,22.42 U1.41
VAREF: length 2
  Bottom Layer w0.203: U1.42 26.72,22.02 26.89,22.19 v2(26.89,22.69)
VGATE1_N: length 6.5
  Top Layer w0.203: Q2.1 25.85,14.54 24.51,13.21 v1(23.88,13.21)
  Bottom Layer w0.203: v1(23.88,13.21) 23.88,11.56 24.61,10.82 U1.70
VGATE1_P: length 9.9
  Top Layer w0.203: v1(22.99,13.59) 23.38,13.98 24.78,13.98 25.44,14.64 25.44,15.9 25.98,16.44 Q2.3
  Bottom Layer w0.203: U1.71 24.51,10.42 22.99,11.94 v1(22.99,13.59)
XTAL1: length 6.2
  Bottom Layer w0.203: U1.81 20.69,7.32 X1.3 23.98,5.16 C12.2
XTAL2: length 7.9
  Bottom Layer w0.203: U1.82 20.29,6.32 20.07,6.1 20.07,3.99 X1.1 21.1,1.1 C11.2
$1N2260: length 28.3
  Top Layer w0.203: R12.1 14.98,12.06 C14.2 13.4,13.27 v2(13.33,13.33)
  Inner1 w0.203: v2(6.48,28.04) 8,26.52 8,15.11 9.02,14.1 12.57,14.1 v2(13.33,13.33)
  Bottom Layer w0.203: SW2.2 2.63,29.75 R6.1 v2(6.48,28.04)
$2N2355: length 2.1
  Bottom Layer w0.254: R7.2 26.45,33.27 U2.1
$2N2718: length 2.1
  Bottom Layer w0.254: U8.1 26.4,34.99 R19.2

## Copper pours and planes (outline as drawn; the poured copper is in the pictures)
GND on Top Layer: 0,36.2 33.78,36.2 33.78,0 0,0
GND on Bottom Layer: 0,36.2 33.78,36.2 33.78,0 0,0
GND on Inner1: 0,36.2 33.78,36.2 33.78,0 0,0
GND on Inner2: 0,36.2 33.78,36.2 33.78,0 0,0
VCC1V25 on Top Layer: 18.8,20.57 20.33,20.57 20.33,13.81 18.8,13.81
VCC3V3 on Top Layer: 22.99,32.77 22.99,33.4 21.86,34.53 21.86,35.55 21.21,36.2 9.65,36.2 9.65,34.29 17.82,34.29 18.21,33.9 21.01,33.9 21.34,33.58 21.34,33.08 21.65,32.77
VCC3V3 on Top Layer: 25.65,15.09 26.82,15.09 26.92,14.99 26.92,13.38 26.71,13.16 26.71,12.23 27.54,12.23 27.54,15.6 27.3,15.84 25.75,15.84 25.65,15.75
VCC5V on Top Layer: 33.4,34.29 31.75,35.94 24.28,35.94 23.9,35.56 23.9,34.65 24,34.54 25.13,34.54 25.63,34.05 31.61,34.05 32.13,33.53 32.13,31.24 31.62,30.73 25.65,30.73 25.15,30.23 24,30.23 23.88,30.1 23.88,29.46 24,29.34 30.81,29.34 31.19,28.95 31.19,22.4 31.5,22.1 33.14,22.1 33.4,22.36
VCCCAM on Top Layer: 17.91,30.45 22.99,30.45 22.99,28.92 17.91,28.92
VCCCAM on Bottom Layer: 17.91,30.45 20.07,30.45 20.07,28.96 17.91,28.96
VDDM on Top Layer: 20.07,23.11 24.2,23.11 24.2,22.16 20.07,22.16
VSSM on Top Layer: 20.07,24.64 24.14,24.64 24.14,23.7 20.07,23.7
VAGND on Top Layer: 24.78,24.68 27.42,24.68 27.42,23.55 24.78,23.55
VAREF on Top Layer: 24.78,23.06 27.43,23.06 27.43,22.1 24.78,22.1
$1N3513 on Top Layer: 22.99,14.22 24.76,14.22 25.27,14.73 25.27,17.45 24.39,18.33 24.39,20.52 22.9,20.52 22.9,16.22 22.99,16.13 24.13,16.13 24.26,16 24.26,14.99 24.13,14.86 22.98,14.86 22.98,14.23
$2N1878 on Top Layer: 25.91,26.93 30.65,26.93 30.65,21.98 28.96,21.98 28.14,22.79 28.14,24.56 27.63,25.07 25.91,25.07

Small or netless copper shapes (teardrops, artwork), in the pictures only: 91 on Top Layer, 110 on Bottom Layer, 32 on Inner1

## Text on the board
Bottom Layer: 20th | Origin | 2025/1/7 | 华东理工大学
Bottom Solder Mask Layer: 20th | Origin | 2025/1/7 | 华东理工大学
Bottom Silkscreen Layer: 11.6 | 13.1 | 11.12 | 11.10 | 15.5 | 15.1 | 15.3 | 20.10 | 20.14 | 20.12 | 11.9 | 11.11 | 13.0 | 13.2 | 15.2 | 15.0 | 15.4 | 20.9 | 20.13 | 20.11 | GND | 33.1 | 33.5 | 33.7 | 23.1 | 22.1 | 22.3 | 33.3 | 02.8 | 5V | 00.9 | 15.8 | 22.2 | 33.0 | 33.2 | 33.4 | 33.6 | 22.0 | PWR | 00.12 | RST
